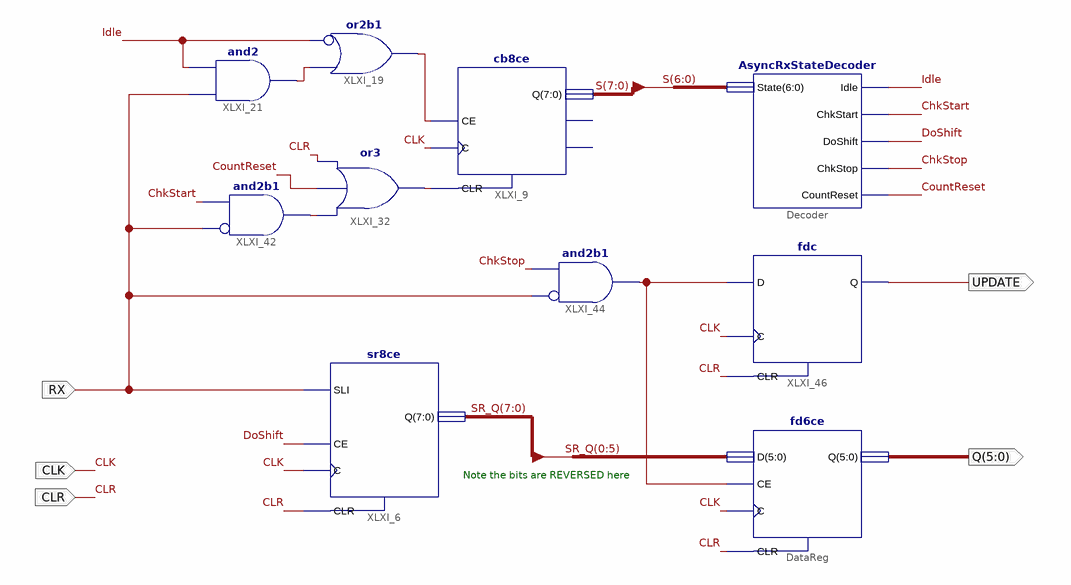
[diagram p0: schematic sheet 1]
// Xilinx ISE schematic AsyncRx.sch (xc9500xl) as structural Verilog: 10 symbols, 5 ports
module AsyncRx (
  input  RX,
  input  CLK,
  input  CLR,
  output [5:0] Q,
  output UPDATE
);

  wire ChkStart, ChkStop, CountReset, DoShift, Idle, XLXN_33, XLXN_34, XLXN_65, XLXN_94, XLXN_136;
  wire [7:0] S, SR_Q;

  cb8ce XLXI_9 (.C(CLK), .CE(XLXN_33), .CLR(XLXN_65), .Q(S));  // open: CEO, TC
  and XLXI_21 (XLXN_34, RX, Idle);
  or XLXI_19 (XLXN_33, ~Idle, XLXN_34);  // or2b1
  or XLXI_32 (XLXN_65, XLXN_94, CountReset, CLR);
  and XLXI_42 (XLXN_94, ~RX, ChkStart);  // and2b1
  sr8ce XLXI_6 (.C(CLK), .CE(DoShift), .CLR(CLR), .SLI(RX), .Q(SR_Q));
  fd6ce DataReg (.C(CLK), .CE(XLXN_136), .CLR(CLR), .D({SR_Q[0], SR_Q[1], SR_Q[2], SR_Q[3], SR_Q[4], SR_Q[5]}), .Q(Q));
  fdc XLXI_46 (.C(CLK), .CLR(CLR), .D(XLXN_136), .Q(UPDATE));
  and XLXI_44 (XLXN_136, ~RX, ChkStop);  // and2b1
  AsyncRxStateDecoder Decoder (
    .State(S[6:0]), .Idle(Idle), .ChkStart(ChkStart), .DoShift(DoShift), .ChkStop(ChkStop),
    .CountReset(CountReset));

  // Notes on the sheet:
  //   Note the bits are REVERSED here
endmodule
